# EAGLE design Watering_System_3.1 (EAGLE 9.6.2)
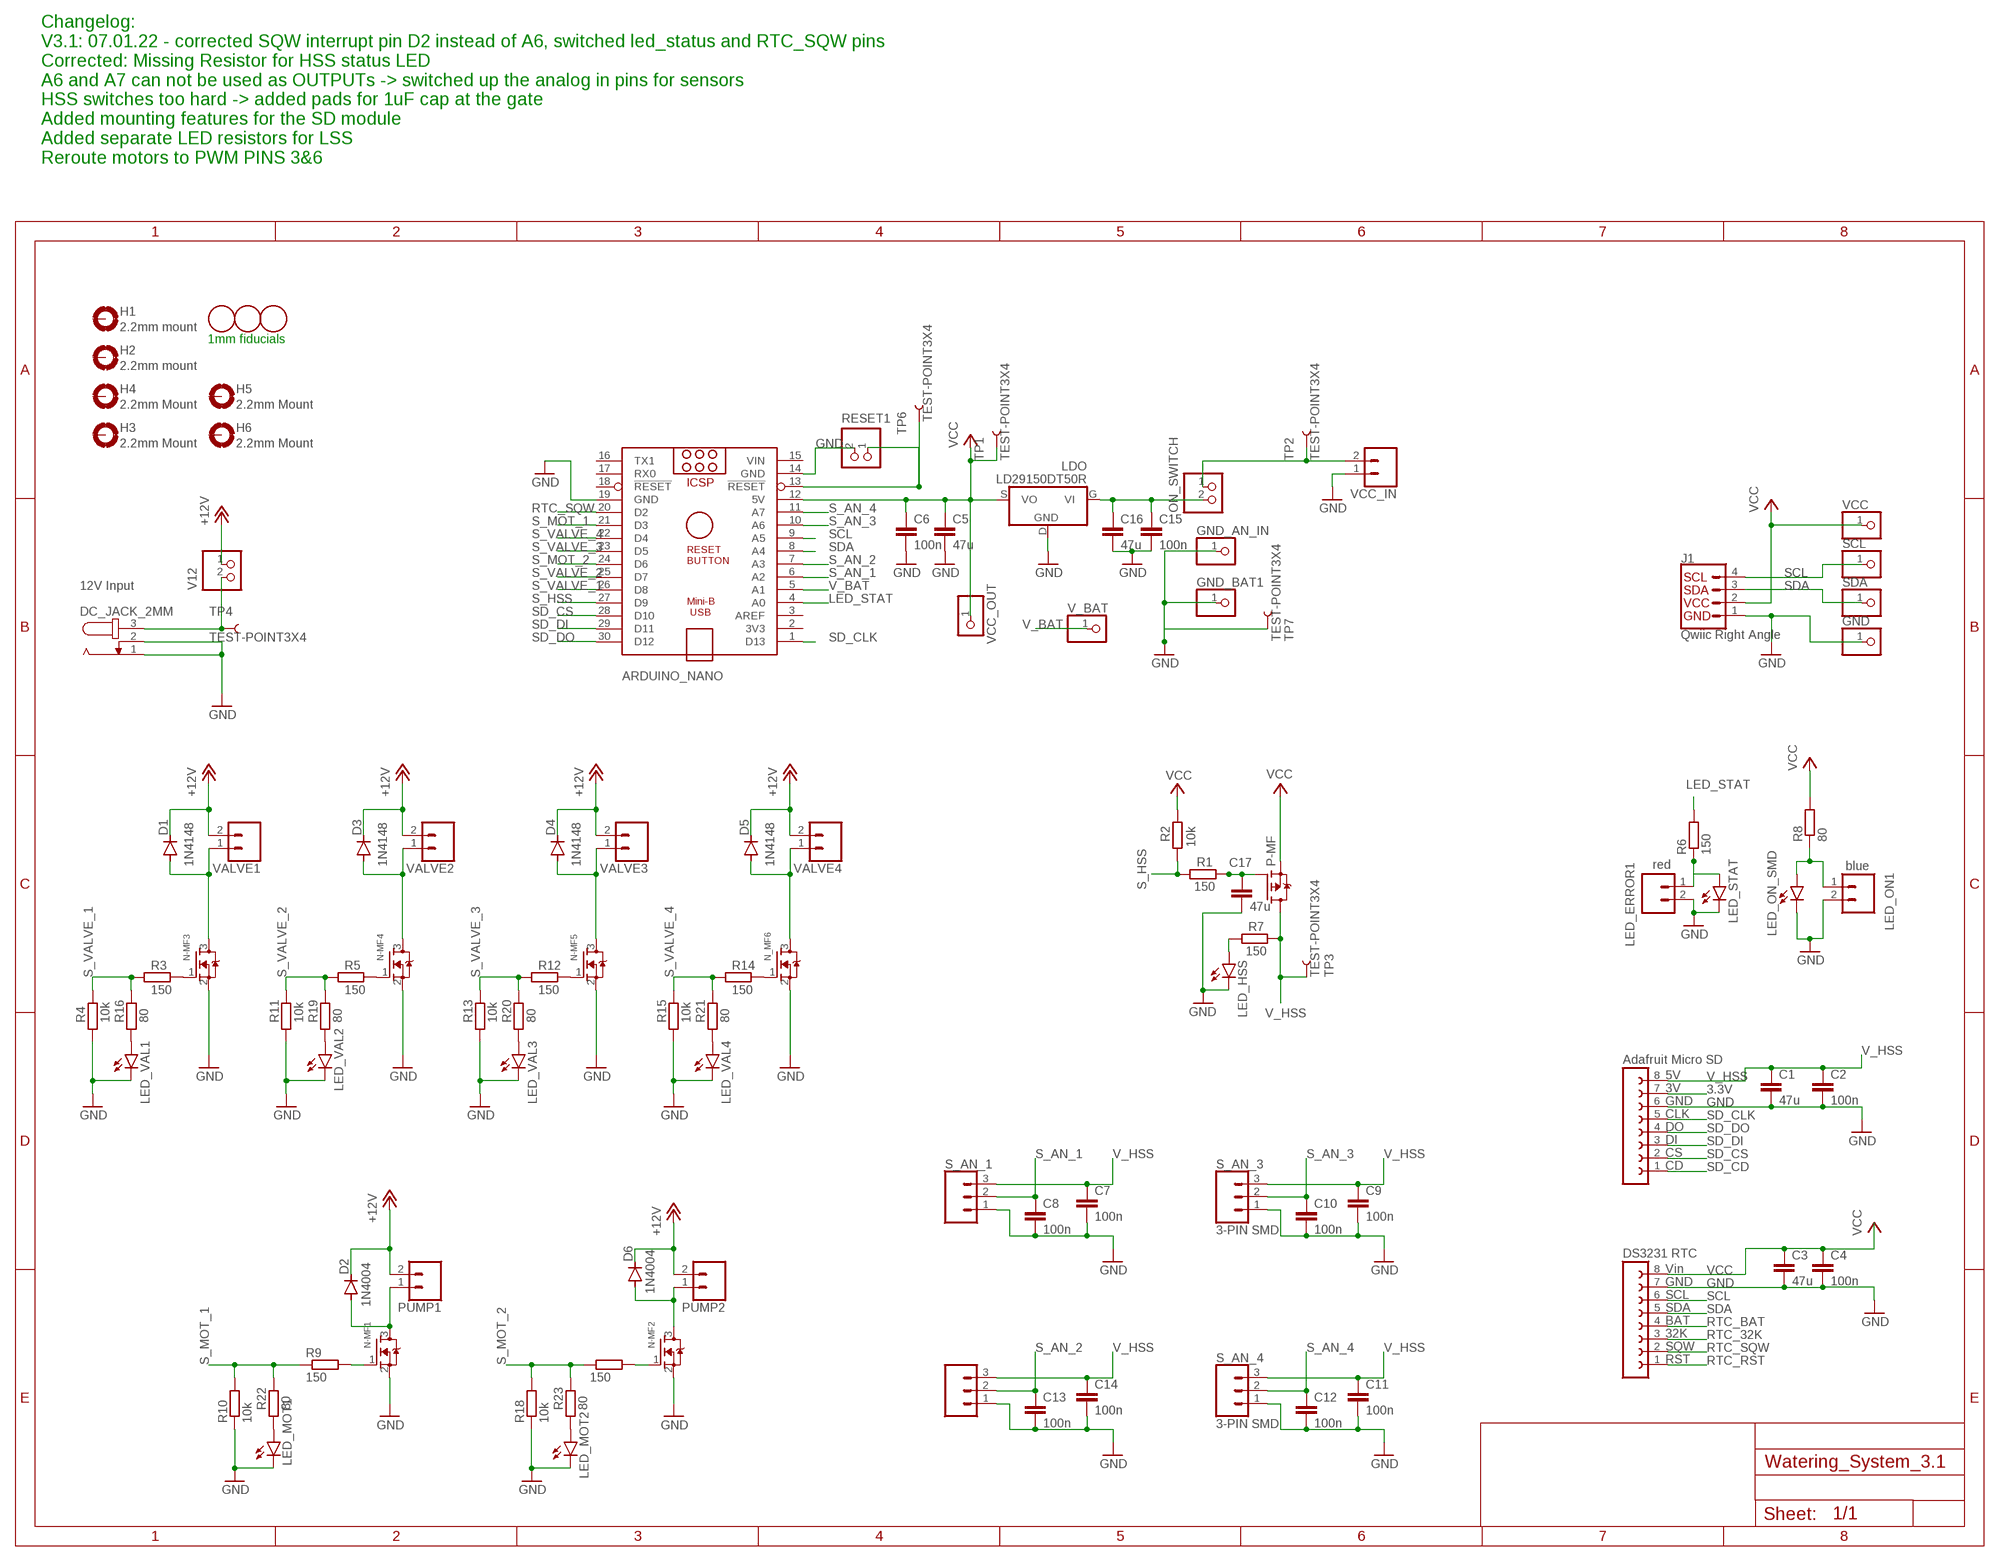
[diagram p0: schematic, sheet 1]

## Parts
ARDUINO_NANO  ARDUINO_NANO  [ARDUINO_NANO]
C1  47u  C-EUC0805  [C0805]
C2  100n  C-EUC0805  [C0805]
C3  47u  C-EUC0805  [C0805]
C4  100n  C-EUC0805  [C0805]
C5  47u  C-EUC0805  [C0805]
C6  100n  C-EUC0805  [C0805]
C7  100n  C-EUC0805  [C0805]
C8  100n  C-EUC0805  [C0805]
C9  100n  C-EUC0805  [C0805]
C10  100n  C-EUC0805  [C0805]
C11  100n  C-EUC0805  [C0805]
C12  100n  C-EUC0805  [C0805]
C13  100n  C-EUC0805  [C0805]
C14  100n  C-EUC0805  [C0805]
C15  100n  C-EUC0805  [C0805]
C16  47u  C-EUC0805  [C0805]
C17  47u  C-EUC0805  [C0805]
D1  1N4148  1N4148DO35-7  [DO35-7]
D2  1N4004  [DO41-10]
D3  1N4148  1N4148DO35-7  [DO35-7]
D4  1N4148  1N4148DO35-7  [DO35-7]
D5  1N4148  1N4148DO35-7  [DO35-7]
D6  1N4004  [DO41-10]
DC_JACK_2MM  12V Input  JACK-PLUG0  [SPC4077]
GND  PINHD-1X1  [1X01]
GND_AN_IN  PINHD-1X1  [1X01]
GND_BAT1  PINHD-1X1  [1X01]
H1  2.2mm mount  MOUNT-PAD-ROUND2.8  [2,2-PAD]
H2  2.2mm mount  MOUNT-PAD-ROUND2.8  [2,2-PAD]
H3  2.2mm Mount  MOUNT-PAD-ROUND2.8  [2,2-PAD]
H4  2.2mm Mount  MOUNT-PAD-ROUND2.8  [2,2-PAD]
H5  2.2mm Mount  MOUNT-PAD-ROUND2.8  [2,2-PAD]
H6  2.2mm Mount  MOUNT-PAD-ROUND2.8  [2,2-PAD]
J1  Qwiic Right Angle  I2C_STANDARDQWIIC  [1X04_1MM_RA]
LDO  LD29150DT50R  [DPACK_2]
LED_ERROR1  red  CONN_02  [1X02]
LED_HSS  LEDCHIPLED_0805  [CHIPLED_0805]
LED_MOT1  LEDCHIPLED_0805  [CHIPLED_0805]
LED_MOT2  LEDCHIPLED_0805  [CHIPLED_0805]
LED_ON1  blue  CONN_02  [1X02]
LED_ON_SMD  LEDCHIPLED_0805  [CHIPLED_0805]
LED_STAT  LEDCHIPLED_0805  [CHIPLED_0805]
LED_VAL1  LEDCHIPLED_0805  [CHIPLED_0805]
LED_VAL2  LEDCHIPLED_0805  [CHIPLED_0805]
LED_VAL3  LEDCHIPLED_0805  [CHIPLED_0805]
LED_VAL4  LEDCHIPLED_0805  [CHIPLED_0805]
N-MF1  IRLML6244TRPBF  [SOT23R_INFINEON]
N-MF2  IRLML6244TRPBF  [SOT23R_INFINEON]
N-MF3  IRLML6244TRPBF  [SOT23R_INFINEON]
N-MF4  IRLML6244TRPBF  [SOT23R_INFINEON]
N-MF5  IRLML6244TRPBF  [SOT23R_INFINEON]
N_MF6  IRLML6244TRPBF  [SOT23R_INFINEON]
ON_SWITCH  toggle_breakout  PINHD-1X2  [1X02]
P-MF  IRLML2244TRPBF  [SOT23R_INFINEON]
PUMP1  CONN_02-JST-2MM-SMT  [JST-2-SMD]
PUMP2  CONN_02-JST-2MM-SMT  [JST-2-SMD]
R1  150  R-EU_R0805  [R0805]
R2  10k  R-EU_R0805  [R0805]
R3  150  R-EU_R0805  [R0805]
R4  10k  R-EU_R0805  [R0805]
R5  150  R-EU_R0805  [R0805]
R6  150  R-EU_R0805  [R0805]
R7  150  R-EU_R0805  [R0805]
R8  80  R-EU_R0805  [R0805]
R9  150  R-EU_R0805  [R0805]
R10  10k  R-EU_R0805  [R0805]
R11  10k  R-EU_R0805  [R0805]
R12  150  R-EU_R0805  [R0805]
R13  10k  R-EU_R0805  [R0805]
R14  150  R-EU_R0805  [R0805]
R15  10k  R-EU_R0805  [R0805]
R16  80  R-EU_R0805  [R0805]
R17  150  R-EU_R0805  [R0805]
R18  10k  R-EU_R0805  [R0805]
R19  80  R-EU_R0805  [R0805]
R20  80  R-EU_R0805  [R0805]
R21  80  R-EU_R0805  [R0805]
R22  80  R-EU_R0805  [R0805]
R23  80  R-EU_R0805  [R0805]
RESET1  toggle_breakout  PINHD-1X2  [1X02]
RTC  DS3231  DS3231_RTC  [RTC]
S_AN_1  3-PIN SMD  CONN_03JST-SMD  [JST-3-SMD]
S_AN_2  3-PIN SMD  CONN_03JST-SMD  [JST-3-SMD]
S_AN_3  3-PIN SMD  CONN_03JST-SMD  [JST-3-SMD]
S_AN_4  3-PIN SMD  CONN_03JST-SMD  [JST-3-SMD]
SC_CARD  MIRCO_SD_ADAFRUITSD  [ADAFRUIT_SD]
SCL  PINHD-1X1  [1X01]
SDA  PINHD-1X1  [1X01]
TP1  TEST-POINT3X4  [PAD.03X.04]
TP2  TEST-POINT3X4  [PAD.03X.04]
TP3  TEST-POINT3X4  [PAD.03X.04]
TP4  TEST-POINT3X4  [PAD.03X.04]
TP6  TEST-POINT3X4  [PAD.03X.04]
TP7  TEST-POINT3X4  [PAD.03X.04]
U$1  FIDUCIAL  [FIDUCIAL_1MM]
U$2  FIDUCIAL  [FIDUCIAL_1MM]
U$3  FIDUCIAL  [FIDUCIAL_1MM]
V12  toggle_breakout  PINHD-1X2  [1X02]
V_BAT  PINHD-1X1  [1X01]
VALVE1  CONN_02-JST-2MM-SMT  [JST-2-SMD]
VALVE2  CONN_02-JST-2MM-SMT  [JST-2-SMD]
VALVE3  CONN_02-JST-2MM-SMT  [JST-2-SMD]
VALVE4  CONN_02-JST-2MM-SMT  [JST-2-SMD]
VCC  PINHD-1X1  [1X01]
VCC_IN  CONN_02-JST-2MM-SMT  [JST-2-SMD]
VCC_OUT  PINHD-1X1  [1X01]

## Nets
3.3V: SC_CARD.7(3V)
+12V: D1.C D2.C D3.C D4.C D5.C D6.C PUMP1.2 PUMP2.2 V12.1 VALVE1.2 VALVE2.2 VALVE3.2 VALVE4.2
GND: ARDUINO_NANO.14(GND) ARDUINO_NANO.19(GND) C1.2 C2.2 C3.2 C4.2 C5.2 C6.2 C7.2 C8.2 C9.2 C10.2 C11.2 C12.2 C13.2 C14.2 C15.2 C16.2 C17.2 DC_JACK_2MM.1 DC_JACK_2MM.2 GND.1 GND_AN_IN.1 GND_BAT1.1 J1.1 LDO.D(GND) LED_ERROR1.2 LED_HSS.C LED_MOT1.C LED_MOT2.C LED_ON1.2 LED_ON_SMD.C LED_STAT.C LED_VAL1.C LED_VAL2.C LED_VAL3.C LED_VAL4.C N-MF1.2(S) N-MF2.2(S) N-MF3.2(S) N-MF4.2(S) N-MF5.2(S) N_MF6.2(S) R4.1 R10.1 R11.1 R13.1 R15.1 R18.1 RESET1.2 RTC.7(GND) S_AN_1.1 S_AN_2.1 S_AN_3.1 S_AN_4.1 SC_CARD.6(GND) TP7.P$1 VCC_IN.1
LED_STAT: ARDUINO_NANO.4(A0) R6.2
N$1: N-MF1.1(G) R9.2
N$2: D3.A N-MF4.3(D) VALVE2.1
N$3: LED_ON1.1 LED_ON_SMD.A R8.1
N$4: N-MF2.1(G) R17.2
N$5: LED_ERROR1.1 LED_STAT.A R6.1
N$6: LED_HSS.A R7.1
N$7: D1.A N-MF3.3(D) VALVE1.1
N$8: N-MF4.1(G) R5.2
N$9: D4.A N-MF5.3(D) VALVE3.1
N$10: C17.1 P-MF.1(G) R1.2
N$11: N-MF3.1(G) R3.2
N$12: N-MF5.1(G) R12.2
N$13: D5.A N_MF6.3(D) VALVE4.1
N$14: N_MF6.1(G) R14.2
N$15: C15.1 C16.1 LDO.G(VI) ON_SWITCH.2
N$16: DC_JACK_2MM.3 TP4.P$1 V12.2
N$17: LED_VAL1.A R16.1
N$18: D2.A N-MF1.3(D) PUMP1.1
N$19: D6.A N-MF2.3(D) PUMP2.1
N$20: LED_VAL2.A R19.1
N$21: ARDUINO_NANO.13(!RESET) RESET1.1 TP6.P$1
N$22: ON_SWITCH.1 TP2.P$1 VCC_IN.2
N$23: LED_VAL3.A R20.1
N$24: LED_VAL4.A R21.1
N$25: LED_MOT1.A R22.1
N$26: LED_MOT2.A R23.1
RTC_32K: RTC.3(32K)
RTC_BAT: RTC.4(BAT)
RTC_RST: RTC.1(RST)
RTC_SQW: ARDUINO_NANO.20(D2) RTC.2(SQW)
S_AN_1: ARDUINO_NANO.6(A2) C8.1 S_AN_1.2
S_AN_2: ARDUINO_NANO.7(A3) C13.1 S_AN_2.2
S_AN_3: ARDUINO_NANO.10(A6) C10.1 S_AN_3.2
S_AN_4: ARDUINO_NANO.11(A7) C12.1 S_AN_4.2
S_HSS: ARDUINO_NANO.27(D9) R1.1 R2.1
S_MOT_1: ARDUINO_NANO.21(D3) R9.1 R10.2 R22.2
S_MOT_2: ARDUINO_NANO.24(D6) R17.1 R18.2 R23.2
S_VALVE_1: ARDUINO_NANO.26(D8) R3.1 R4.2 R16.2
S_VALVE_2: ARDUINO_NANO.25(D7) R5.1 R11.2 R19.2
S_VALVE_3: ARDUINO_NANO.23(D5) R12.1 R13.2 R20.2
S_VALVE_4: ARDUINO_NANO.22(D4) R14.1 R15.2 R21.2
SCL: ARDUINO_NANO.9(A5) J1.4 RTC.6(SCL) SCL.1
SD_CD: SC_CARD.1(CD)
SD_CLK: ARDUINO_NANO.1(D13) SC_CARD.5(CLK)
SD_CS: ARDUINO_NANO.28(D10) SC_CARD.2(CS)
SD_DI: ARDUINO_NANO.29(D11) SC_CARD.3(DI)
SD_DO: ARDUINO_NANO.30(D12) SC_CARD.4(DO)
SDA: ARDUINO_NANO.8(A4) J1.3 RTC.5(SDA) SDA.1
V_BAT: ARDUINO_NANO.5(A1) V_BAT.1
V_HSS: C1.1 C2.1 C7.1 C9.1 C11.1 C14.1 P-MF.3(D) R7.2 S_AN_1.3 S_AN_2.3 S_AN_3.3 S_AN_4.3 SC_CARD.8(5V) TP3.P$1
VCC: ARDUINO_NANO.12(5V) C3.1 C4.1 C5.1 C6.1 J1.2 LDO.S(VO) P-MF.2(S) R2.2 R8.2 RTC.8(VIN) TP1.P$1 VCC.1 VCC_OUT.1
Unconnected: ARDUINO_NANO.2(3V3) ARDUINO_NANO.3(AREF) ARDUINO_NANO.16(TX1) ARDUINO_NANO.17(RX0) ARDUINO_NANO.18(!RESET) H1.B2,2(MOUNT) H2.B2,2(MOUNT) H3.B2,2(MOUNT) H4.B2,2(MOUNT) H5.B2,2(MOUNT) H6.B2,2(MOUNT)

## Notes on the sheet
- Changelog:
  V3.1: 07.01.22 - corrected SQW interrupt pin D2 instead of A6, switched led_status and RTC_SQW pins
  Corrected: Missing Resistor for HSS status LED 
  A6 and A7 can not be used as OUTPUTs -> switched up the analog in pins for sensors
  HSS switches too hard -> added pads for 1uF cap at the gate 
  Added mounting features for the SD module
  Added separate LED resistors for LSS 
  Reroute motors to PWM PINS 3&6
- 1mm fiducials

## Power pins joined to a net without a drawn wire
VIN: ARDUINO_NANO.15(VIN)

## Library data of the parts
ARDUINO_NANO = ArduinoNanoV30_no_holes:ARDUINO_NANO: Arduino Nano V3.0 Overview: The Arduino Nano is a small, complete, and breadboard-friendly board based on the ATmega328 (Arduino Nano 3.x) or ATmega168 (Arduino Nano 2.x). It has more or less the same functionality of the Arduino Duemilanove, but in a different package. It lacks only a DC power jack, and works with a Mini-B USB cable instead of a standard one. The Nano was designed and is being produced by Gravitech. Specifications: Microcontroller Atmel ATmega168 or ATmega328 Operating Voltage (logic level) 5 V Input Voltage (recommended) 7-12 V Input Voltage (limits) 6-20 V Digital I/O Pins 14 (of which 6 provide PWM output) Analog Input Pins 8 DC Current per I/O Pin 40 mA Flash Memory 16 KB (ATmega168) or 32 KB (ATmega328) of which 2 KB used by bootloader SRAM 1 KB (ATmega168) or 2 KB (ATmega328) EEPROM 512 bytes (ATmega168) or 1 KB (ATmega328) Clock Speed 16 MHz Dimensions 0.73" x 1.70" Length 45 mm Width 18 mm Weigth 5 g Power: The Arduino Nano can be powered via the Mini-B USB connection, 6-20V unregulated external power supply (pin 30), or 5V regulated external power supply (pin 27). The power source is automatically selected to the highest voltage source. Memory: The ATmega168 has 16 KB of flash memory for storing code (of which 2 KB is used for the bootloader); the ATmega328 has 32 KB, (also with 2 KB used for the bootloader). The ATmega168 has 1 KB of SRAM and 512 bytes of EEPROM (which can be read and written with the EEPROM library); the ATmega328 has 2 KB of SRAM and 1 KB of EEPROM. Input and Output: Each of the 14 digital pins on the Nano can be used as an input or output, using pinMode(), digitalWrite(), and digitalRead() functions. They operate at 5 volts. Each pin can provide or receive a maximum of 40 mA and has an internal pull-up resistor (disconnected by default) of 20-50 kOhms. In addition, some pins have specialized functions. Visit Arduino - ArduinoBoardNano <https://www.arduino.cc/en/Main/ArduinoBoardNano>
C1-C17 = rcl:C-EU: CAPACITOR, European symbol; SPICEPREFIX: C
D1 D3-D5 = diode:1N4148: DIODE high speed (Philips)
D2 D6 = diode:1N4004: DIODE general purpose rectifier, 1 A
DC_JACK_2MM = con-jack:JACK-PLUG: DC POWER JACK Power Jack, DC, Right Angle, Through Hole, Rated 5A at 16VDC, PC Terminals Distributor: Farnell (www.Farnell.de) Drawing: 84N1161.pdf / 84N1162.pdf Manufacturer: SPC Technology (www.spctechnology.com) Type: SPC4077 / SPC 4078; OC_FARNELL: unknown; OC_NEWARK: unknown
GND GND_AN_IN GND_BAT1 SCL SDA V_BAT VCC VCC_OUT = adafruit:PINHD-1X1: Pin header 1x1 for 0.1" spacing With round pins
H1-H6 = MeineBauteile:MOUNT-PAD-ROUND: MOUNTING PAD, round
J1 = SparkFun-Connectors:I2C_STANDARD: SparkFun I2C Standard Pinout Header SparkFun has standardized on a pinout for all I2C based sensor breakouts. This pinout allows I2C boards to be plugged directly into the headers on Arduino Uno compatible boards, and to be daisy chained easily. Example SparkFun Products: SparkFun Atmospheric Sensor Breakout - BME280 <https://www.sparkfun.com/products/13676> SparkFun Altitude/Pressure Sensor Breakout - MPL3115A2 <https://www.sparkfun.com/products/11084> SparkFun TOF Range Finder Sensor - VL6180 <https://www.sparkfun.com/products/12785>; PROD_ID: CONN-13729
LDO = MeineBauteile:LD29150DT50R: Low Dropout Regulator STMicroelectronics Datasheet: https://datasheet.lcsc.com/szlcsc/1806112227_STMicroelectronics-LD29150DT50R_C157411.pdf
LED_ERROR1 LED_ON1 = SparkFun-Connectors:CONN_02: Multi connection point. Often used as Generic Header-pin footprint for 0.1 inch spaced/style header connections On any of the 0.1 inch spaced packages, you can populate with these: Break Away Headers - Straight <https://www.sparkfun.com/products/116> (PRT-00116) Break Away Male Headers - Right Angle <https://www.sparkfun.com/products/553> (PRT-00553) Female Headers <https://www.sparkfun.com/products/115> (PRT-00115) Break Away Headers - Machine Pin <https://www.sparkfun.com/products/117> (PRT-00117) Break Away Female Headers - Swiss Machine Pin <https://www.sparkfun.com/products/743> (PRT-00743) For SCREWTERMINALS and SPRING TERMINALS visit here: Screw Terimnals on SparkFun.com <https://www.sparkfun.com/search/results?term=Screw+Terminals> (5mm/3.5mm/2.54mm spacing) This device is also useful as a general connection point to wire up your design to another part of your project. Our various solder wires solder well into these plated through hole pads. Hook-Up Wire - Assortment (Stranded, 22 AWG) <https://www.sparkfun.com/products/11375> (PRT-11375) Hook-Up Wire - Assortment (Solid Core, 22 AWG) <https://www.sparkfun.com/products/11367> (PRT-11367) View the entire wire category on our website here <https://www.sparkfun.com/categories/141> Special notes: Molex polarized connector foot print use with: PRT-08233 with associated crimp pins and housings. 2.54_SCREWTERM for use with PRT-10571. 3.5mm Screw Terminal footprints for PRT-08084 5mm Screw Terminal footprints for use with PRT-08432
LED_HSS LED_MOT1 LED_MOT2 LED_ON_SMD LED_STAT LED_VAL1-LED_VAL4 = led:LED: LED OSRAM: - CHIPLED LG R971, LG N971, LY N971, LG Q971, LY Q971, LO R971, LY R971 LH N974, LH R974 LS Q976, LO Q976, LY Q976 LO Q996 - Hyper CHIPLED LW Q18S LB Q993, LB Q99A, LB R99A - SideLED LS A670, LO A670, LY A670, LG A670, LP A670 LB A673, LV A673, LT A673, LW A673 LH A674 LY A675 LS A676, LA A676, LO A676, LY A676, LW A676 LS A679, LY A679, LG A679 - Hyper Micro SIDELED® LS Y876, LA Y876, LO Y876, LY Y876 LT Y87S - SmartLED LW L88C, LW L88S LB L89C, LB L89S, LG L890 LS L89K, LO L89K, LY L89K LS L896, LA L896, LO L896, LY L896 - TOPLED LS T670, LO T670, LY T670, LG T670, LP T670 LSG T670, LSP T670, LSY T670, LOP T670, LYG T670 LG T671, LOG T671, LSG T671 LB T673, LV T673, LT T673, LW T673 LH T674 LS T676, LA T676, LO T676, LY T676, LB T676, LH T676, LSB T676, LW T676 LB T67C, LV T67C, LT T67C, LS T67K, LO T67K, LY T67K, LW E67C LS E67B, LA E67B, LO E67B, LY E67B, LB E67C, LV E67C, LT E67C LW T67C LS T679, LY T679, LG T679 LS T770, LO T770, LY T770, LG T770, LP T770 LB T773, LV T773, LT T773, LW T773 LH T774 LS E675, LA E675, LY E675, LS T675 LS T776, LA T776, LO T776, LY T776, LB T776 LHGB T686 LT T68C, LB T68C - Hyper Mini TOPLED® LB M676 - Mini TOPLED Santana® LG M470 LS M47K, LO M47K, LY M47K Source: http://www.osram.convergy.de LUXEON: - LUMILED® LXK2-PW12-R00, LXK2-PW12-S00, LXK2-PW14-U00, LXK2-PW14-V00 LXK2-PM12-R00, LXK2-PM12-S00, LXK2-PM14-U00 LXK2-PE12-Q00, LXK2-PE12-R00, LXK2-PE12-S00, LXK2-PE14-T00, LXK2-PE14-U00 LXK2-PB12-K00, LXK2-PB12-L00, LXK2-PB12-M00, LXK2-PB14-N00, LXK2-PB14-P00, LXK2-PB14-Q00 LXK2-PR12-L00, LXK2-PR12-M00, LXK2-PR14-Q00, LXK2-PR14-R00 LXK2-PD12-Q00, LXK2-PD12-R00, LXK2-PD12-S00 LXK2-PH12-R00, LXK2-PH12-S00 LXK2-PL12-P00, LXK2-PL12-Q00, LXK2-PL12-R00 Source: www.luxeon.com KINGBRIGHT: KA-3528ASYC Source: www.kingbright.com
N-MF1-N-MF5 N_MF6 = MeineBauteile:IRLML6244TRPBF: Infineon N Channel MOSFET V_DS = 20V V_GS = +-12V https://lcsc.com/product-detail/MOSFET_Infineon-Technologies-IRLML6244TRPBF_C143946.html Datasheet: https://datasheet.lcsc.com/szlcsc/1810010522_Infineon-Technologies-IRLML6244TRPBF_C143946.pdf
ON_SWITCH RESET1 V12 = pinhead:PINHD-1X2: PIN HEADER
P-MF = MeineBauteile:IRLML2244TRPBF: Infineon P Channel MOSFET Datasheet: https://datasheet.lcsc.com/szlcsc/1808281739_Infineon-Technologies-IRLML2244TRPBF_C169763.pdf
PUMP1 PUMP2 VALVE1-VALVE4 VCC_IN = SparkFun-Connectors:CONN_02: Multi connection point. Often used as Generic Header-pin footprint for 0.1 inch spaced/style header connections On any of the 0.1 inch spaced packages, you can populate with these: Break Away Headers - Straight <https://www.sparkfun.com/products/116> (PRT-00116) Break Away Male Headers - Right Angle <https://www.sparkfun.com/products/553> (PRT-00553) Female Headers <https://www.sparkfun.com/products/115> (PRT-00115) Break Away Headers - Machine Pin <https://www.sparkfun.com/products/117> (PRT-00117) Break Away Female Headers - Swiss Machine Pin <https://www.sparkfun.com/products/743> (PRT-00743) For SCREWTERMINALS and SPRING TERMINALS visit here: Screw Terimnals on SparkFun.com <https://www.sparkfun.com/search/results?term=Screw+Terminals> (5mm/3.5mm/2.54mm spacing) This device is also useful as a general connection point to wire up your design to another part of your project. Our various solder wires solder well into these plated through hole pads. Hook-Up Wire - Assortment (Stranded, 22 AWG) <https://www.sparkfun.com/products/11375> (PRT-11375) Hook-Up Wire - Assortment (Solid Core, 22 AWG) <https://www.sparkfun.com/products/11367> (PRT-11367) View the entire wire category on our website here <https://www.sparkfun.com/categories/141> Special notes: Molex polarized connector foot print use with: PRT-08233 with associated crimp pins and housings. 2.54_SCREWTERM for use with PRT-10571. 3.5mm Screw Terminal footprints for PRT-08084 5mm Screw Terminal footprints for use with PRT-08432; PROD_ID: CONN-11443
R1-R23 = rcl:R-EU_: RESISTOR, European symbol; SPICEPREFIX: R
RTC = MeineBauteile:DS3231_RTC: FEMALE HEADER; OC_FARNELL: unknown; OC_NEWARK: unknown
S_AN_1-S_AN_4 = SparkFun-Connectors:CONN_03: Multi connection point. Often used as Generic Header-pin footprint for 0.1 inch spaced/style header connections On any of the 0.1 inch spaced packages, you can populate with these: Break Away Headers - Straight <https://www.sparkfun.com/products/116> (PRT-00116) Break Away Male Headers - Right Angle <https://www.sparkfun.com/products/553> (PRT-00553) Female Headers <https://www.sparkfun.com/products/115> (PRT-00115) Break Away Headers - Machine Pin <https://www.sparkfun.com/products/117> (PRT-00117) Break Away Female Headers - Swiss Machine Pin <https://www.sparkfun.com/products/743> (PRT-00743) Stackable Header - 3 Pin (Female, 0.1") <https://www.sparkfun.com/products/13875> (PRT-13875) For SCREWTERMINALS and SPRING TERMINALS visit here: Screw Terimnals on SparkFun.com <https://www.sparkfun.com/search/results?term=Screw+Terminals> (5mm/3.5mm/2.54mm spacing) This device is also useful as a general connection point to wire up your design to another part of your project. Our various solder wires solder well into these plated through hole pads. Hook-Up Wire - Assortment (Stranded, 22 AWG) <https://www.sparkfun.com/products/11375> (PRT-11375) Hook-Up Wire - Assortment (Solid Core, 22 AWG) <https://www.sparkfun.com/products/11367> (PRT-11367) View the entire wire category on our website here <https://www.sparkfun.com/categories/141> Special notes: Molex polarized connector foot print use with SKU : PRT-08232 with associated crimp pins and housings.; PROD_ID: CONN-12591
SC_CARD = MeineBauteile:MIRCO_SD_ADAFRUIT: FEMALE HEADER
TP1-TP4 TP6 TP7 = SparkFun-Connectors:TEST-POINT: SparkFun Test Points Bare copper test points for troubleshooting or In-Circuit-Testing. These are used by our Production team for verifying production board runs using pogo-pins on test beds. SparkFun Products: SparkFun LSM9DS1 Breakout <https://www.sparkfun.com/products/13284> SparkFun PSOC <https://www.sparkfun.com/products/13714> SparkFun Load Cell Amplifier <https://www.sparkfun.com/products/13879>
U$1-U$3 = adafruit:FIDUCIAL: For use by pick and place machines to calibrate the vision/machine, 1mm By microbuilder.eu

## Board
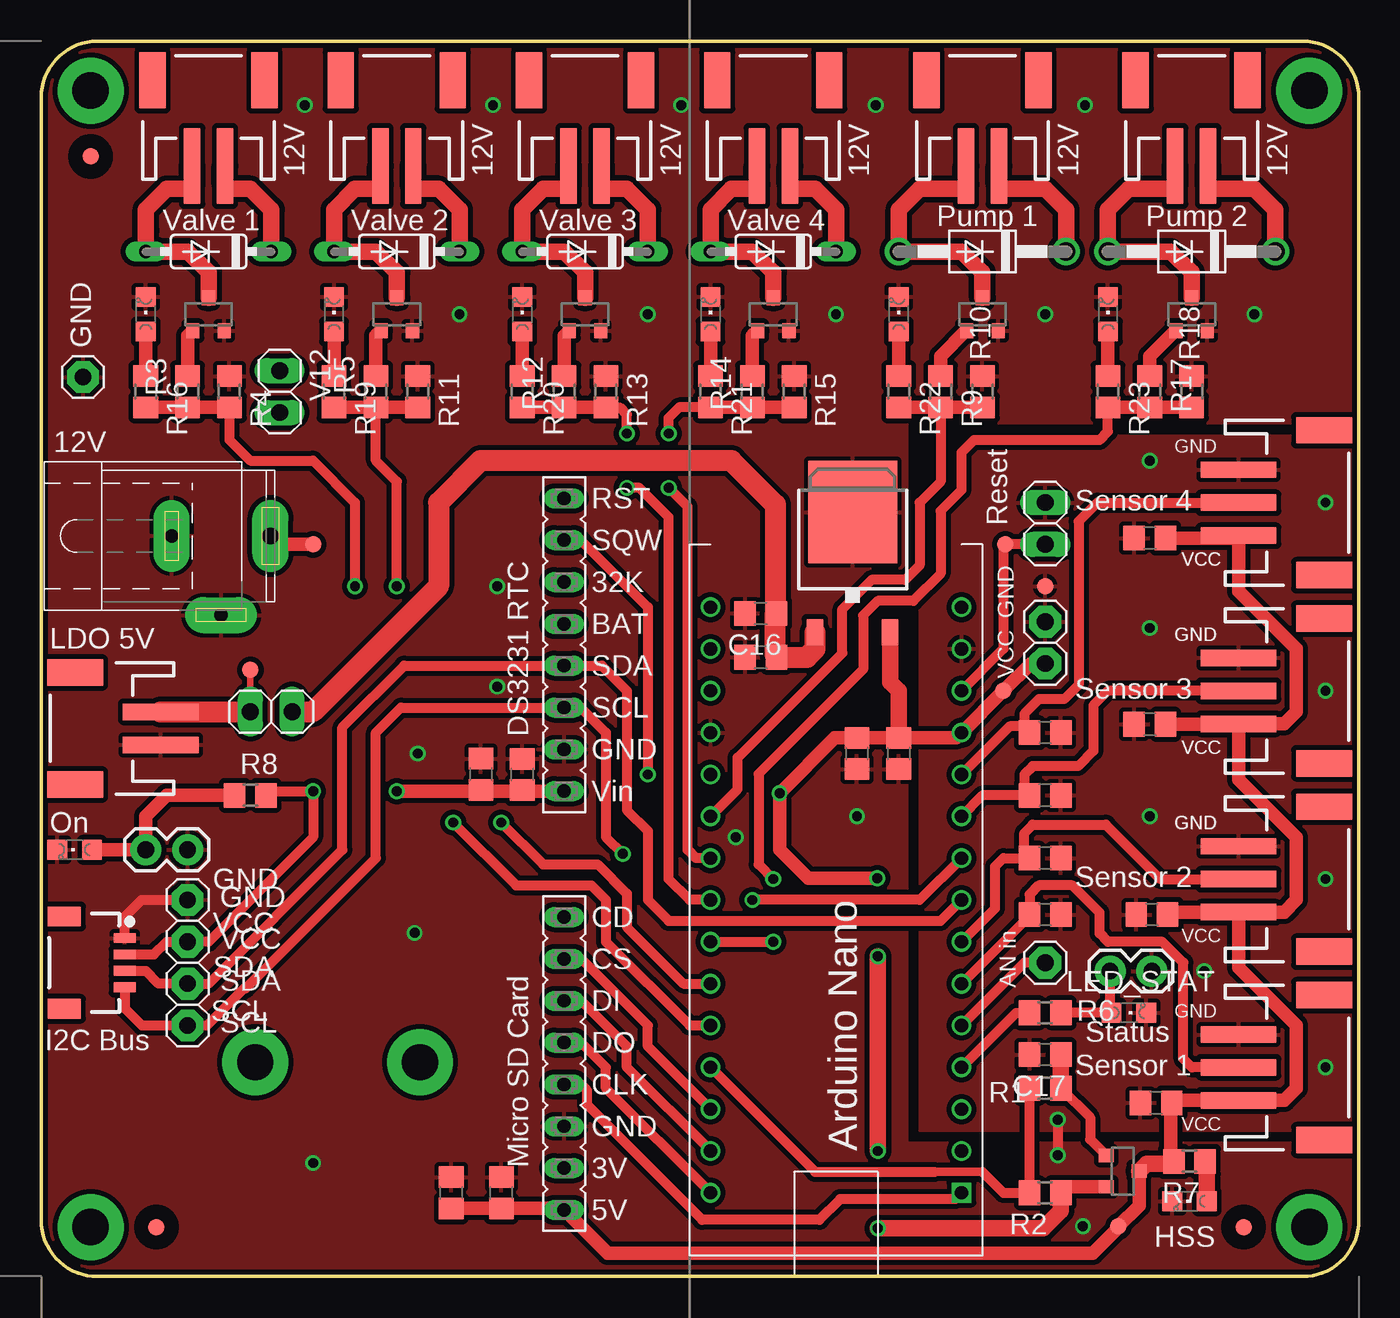
[diagram p1: board, top side]
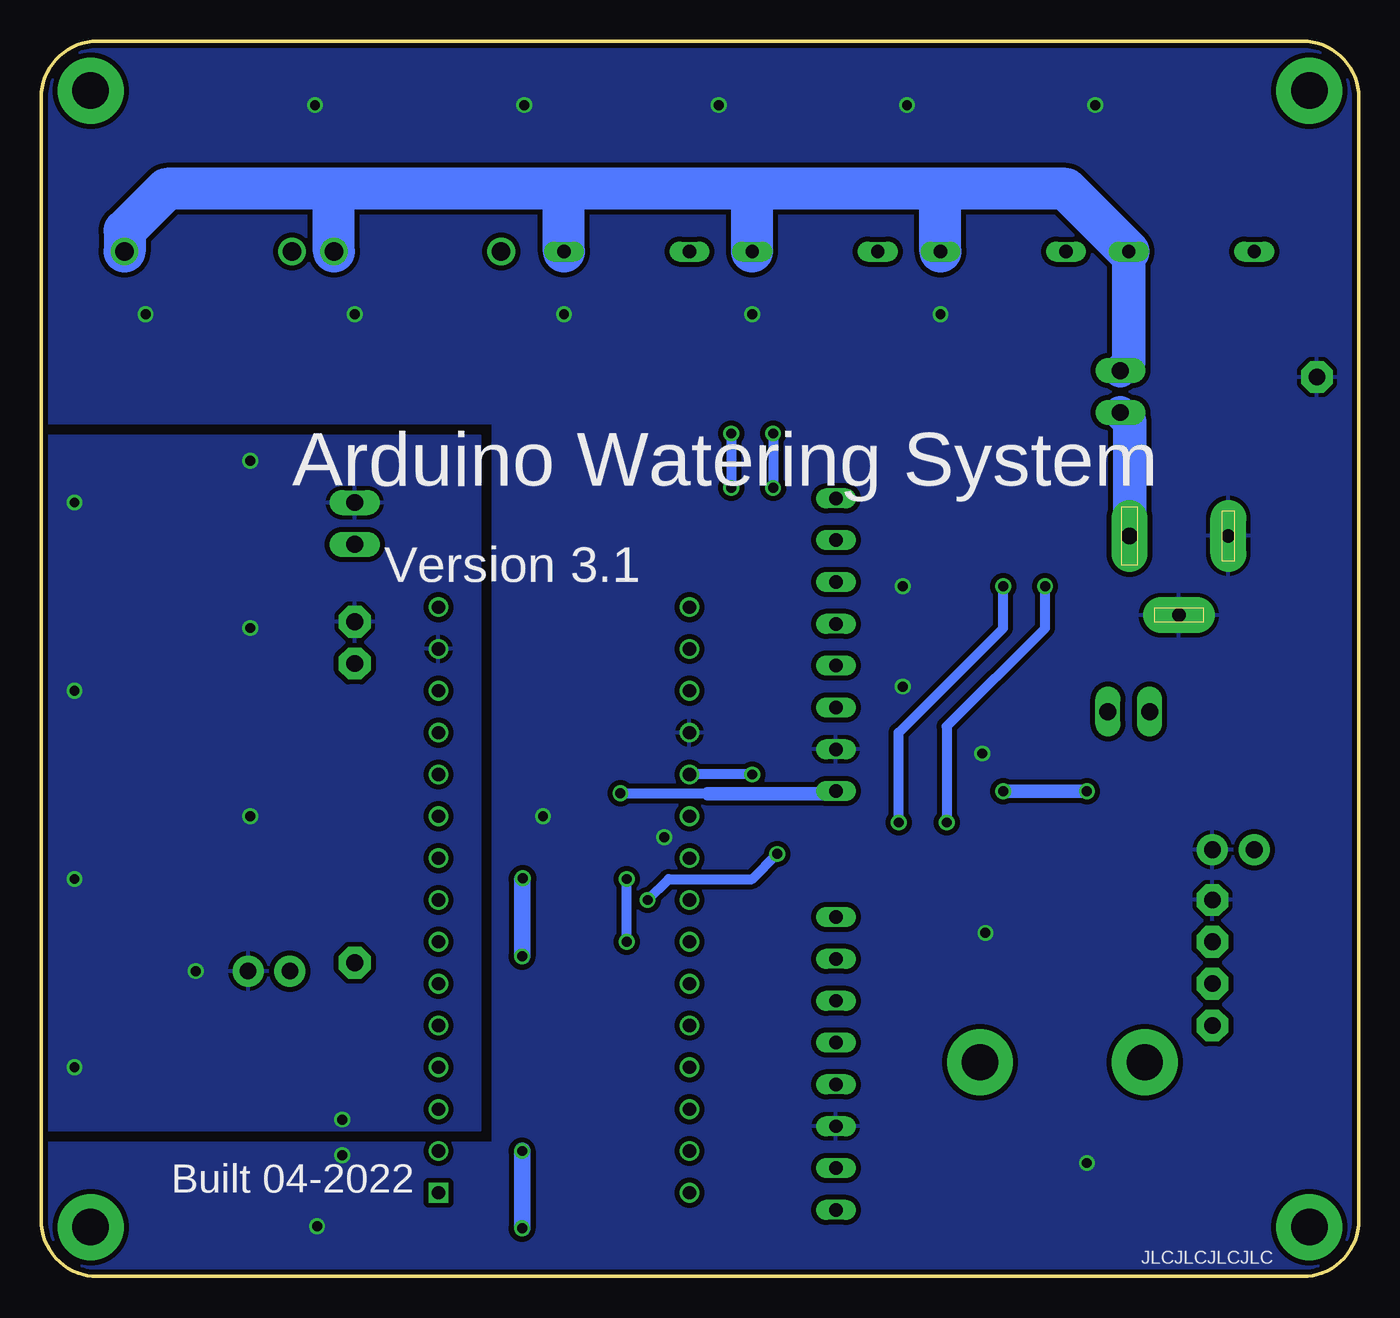
[diagram p2: board, bottom side, seen from below]

Size 80 x 75 mm. Coordinates in mm from the lower left corner, seen from the top.
Outline: 0,3.41 0,71.59 arc-90 3.41,75 76.59,75 arc-90 80,71.59 80,3.41 arc-90 76.59,0 3.41,0 arc-90 0,3.41
Copper layers (1*16): Top 0.035mm / dielectric 1.5mm / Bottom 0.035mm
Design rules "SparkFun-2-Layer-General-JLCPCB": minimum track width 7mil, minimum drill 0.3mm, track to track 7mil, track to pad 7mil, pad to pad 7mil, via to via 7mil, smd to smd 7mil, copper to edge 7mil, drill to drill 7mil, minimum pad ring 7mil, minimum via ring 7mil, stop-mask expansion 3mil, vias tented up to drill 25mil, thermal gap 10mil

### Footprints (pad centres in the part's own frame; a part is rotated, then mirrored left to right if it is on the bottom)
ARDUINO_NANO = drill 0.8 square: 1 -20.32,-7.62 | drill 0.8: 2 -17.78,-7.62; 3 -15.24,-7.62; 4 -12.7,-7.62; 5 -10.16,-7.62; 6 -7.62,-7.62; 7 -5.08,-7.62; 8 -2.54,-7.62; 9 0,-7.62; 10 2.54,-7.62; 11 5.08,-7.62; 12 7.62,-7.62; 13 10.16,-7.62; 14 12.7,-7.62; 15 15.24,-7.62; 16 15.24,7.62; 17 12.7,7.62; 18 10.16,7.62; 19 7.62,7.62; 20 5.08,7.62; 21 2.54,7.62; 22 0,7.62; 23 -2.54,7.62; 24 -5.08,7.62; 25 -7.62,7.62; 26 -10.16,7.62; 27 -12.7,7.62; 28 -15.24,7.62; 29 -17.78,7.62; 30 -20.32,7.62
C0805 = smd 1.3 x 1.5: 1 -0.95,0; 2 0.95,0
DO35-7 = drill 0.813 long: A 3.81,0; C -3.81,0
DO41-10 = drill 1.118: A 5.08,0; C -5.08,0
SPC4077 = drill 0.8 pad 2.184 long: 1 -3,0; 2 0,-4.8 | drill 1 pad 2.184 long: 3 3,0
1X01 = drill 1.016 pad 1.93 octagon: 1 0,0
2,2-PAD = drill 2.2 pad 4: B2,2 0,0
1X04_1MM_RA = smd 0.6 x 1.35: 1 -1.5,0; 2 -0.5,0; 3 0.5,0; 4 1.5,0 | smd 1.2 x 2: NC1 2.8,-3.675; NC2 -2.8,-3.675
DPACK_2 = smd 5.4 x 6.2: D 0,2.5 | smd 1 x 1.6: G -2.28,-4.8; S 2.28,-4.8
1X02 = drill 1.016 pad 1.88: 1 0,0; 2 2.54,0
CHIPLED_0805 = smd 1.2 x 1.2: A 0,-1.05; C 0,1.05
SOT23R_INFINEON = smd 0.8 x 0.9: 1 -0.95,-1; 2 0.95,-1; 3 0,1
1X02' = drill 1.016 long: 1 -1.27,0; 2 1.27,0
JST-2-SMD = smd 1 x 4.6: 1 -1,-3.7; 2 1,-3.7 | smd 1.6 x 3.4: NC1 -3.4,1.5; NC2 3.4,1.5
R0805 = smd 1.3 x 1.5: 1 -0.95,0; 2 0.95,0
RTC = drill 0.813 long: 1 -8.89,0; 2 -6.35,0; 3 -3.81,0; 4 -1.27,0; 5 1.27,0; 6 3.81,0; 7 6.35,0; 8 8.89,0
JST-3-SMD = smd 1 x 4.6: 1 -1.99,-4.77; 2 0.01,-4.77; 3 2.01,-4.77 | smd 1.6 x 3.4: NC1 -4.39,0.43; NC2 4.41,0.43
ADAFRUIT_SD = drill 0.813 long: 1 -8.89,0; 2 -6.35,0; 3 -3.81,0; 4 -1.27,0; 5 1.27,0; 6 3.81,0; 7 6.35,0; 8 8.89,0
PAD.03X.04 = smd 1.016 x 1.016: P$1 0,0
FIDUCIAL_1MM = smd 1 x 1: 1 0,0

### Placement (x,y rotation side)
ARDUINO_NANO  48.26,25.4 90 top
C1  27.94,5.08 90 top
C2  24.89,5.08 90 top
C3  26.7,30.5 90 top
C4  29.21,30.48 90 top
C5  49.53,31.75 270 top
C6  52.07,31.75 270 top
C7  67.69,10.54 180 top
C8  60.96,21.97 0 top
C9  67.31,33.53 180 top
C10  60.96,29.21 0 top
C11  67.31,44.83 180 top
C12  60.96,33.02 0 top
C13  60.96,25.4 0 top
C14  67.44,21.97 180 top
C15  43.69,37.59 180 top
C16  43.69,40.26 180 top
C17  60.96,13.47 180 top
D1  10.16,62.23 180 top
D2  57.15,62.23 180 top
D3  21.59,62.23 180 top
D4  33.02,62.23 180 top
D5  44.45,62.23 180 top
D6  69.85,62.23 180 top
DC_JACK_2MM  10.92,44.96 0 top
GND  8.89,22.86 0 top
GND_AN_IN  60.96,39.75 0 top
GND_BAT1  2.54,54.61 0 top
H1  77,3 0 top
H2  3,3 0 top
H3  3,72 0 top
H4  77,72 0 top
H5  23,13 0 top
H6  13,13 0 top
J1  5.08,19.05 270 top
LDO  49.26,43.91 0 top
LED_ERROR1  64.9,18.54 0 top
LED_HSS  69.72,4.57 90 top
LED_MOT1  52.07,58.42 0 top
LED_MOT2  64.77,58.42 0 top
LED_ON1  6.35,25.91 0 top
LED_ON_SMD  2.03,25.91 90 top
LED_STAT  66.04,16.01 270 top
LED_VAL1  6.35,58.42 0 top
LED_VAL2  17.78,58.42 0 top
LED_VAL3  29.21,58.42 0 top
LED_VAL4  40.64,58.42 0 top
N-MF1  57.15,58.42 0 top
N-MF2  69.85,58.42 0 top
N-MF3  10.16,58.42 0 top
N-MF4  21.59,58.42 0 top
N-MF5  33.02,58.42 0 top
N_MF6  44.45,58.42 0 top
ON_SWITCH  toggle_breakout  [1X02']  13.97,34.29 0 top
P-MF  65.66,6.4 270 top
PUMP1  57.15,71.12 0 top
PUMP2  69.85,71.12 0 top
R1  60.96,11.43 0 top
R2  60.96,5.08 0 top
R3  8.89,53.72 90 top
R4  11.43,53.72 270 top
R5  20.32,53.72 90 top
R6  60.96,16.01 180 top
R7  69.72,6.99 180 top
R8  12.7,29.21 0 top
R9  54.61,53.72 90 top
R10  57.15,53.72 270 top
R11  22.86,53.72 270 top
R12  31.75,53.72 90 top
R13  34.29,53.72 270 top
R14  43.18,53.72 90 top
R15  45.72,53.72 270 top
R16  6.35,53.72 270 top
R17  67.31,53.72 90 top
R18  69.85,53.72 270 top
R19  17.78,53.72 270 top
R20  29.21,53.72 270 top
R21  40.64,53.72 270 top
R22  52.07,53.72 270 top
R23  64.77,53.72 270 top
RESET1  toggle_breakout  [1X02']  60.96,45.72 90 top
RTC  31.75,38.35 270 top
S_AN_1  77.47,12.7 270 top
S_AN_2  77.47,24.13 270 top
S_AN_3  77.47,35.56 270 top
S_AN_4  77.47,46.99 270 top
SC_CARD  31.75,12.93 270 top
SCL  8.89,15.24 0 top
SDA  8.89,17.78 0 top
TP1  58.42,35.56 0 top
TP2  12.7,36.83 0 top
TP3  65.41,3.05 270 top
TP4  16.51,44.45 0 top
TP6  58.55,44.45 0 top
TP7  60.96,41.91 0 top
U$1  7,3 0 top
U$2  3,68 0 top
U$3  73,3 0 top
V12  toggle_breakout  [1X02']  14.48,53.72 270 top
V_BAT  60.96,19.05 0 top
VALVE1  10.16,71.12 0 top
VALVE2  21.59,71.12 0 top
VALVE3  33.02,71.12 0 top
VALVE4  44.45,71.12 0 top
VCC  8.89,20.32 0 top
VCC_IN  3.56,33.27 90 top
VCC_OUT  60.96,37.21 0 top

### Tracks (layer width: path | path; a pad name or v marks a point on that pad's centre or on a via)
+12V
  Top 1.016: D3.C 25.4,64.77 24.13,66.04 22.86,66.04 22.59,66.31 VALVE2.2 | D4.C 36.83,64.77 35.56,66.04 34.29,66.04 34.02,66.31 VALVE3.2 | D5.C 48.26,64.77 46.99,66.04 45.72,66.04 45.45,66.31 VALVE4.2 | D2.C 62.23,64.77 60.96,66.04 58.42,66.04 58.15,66.31 PUMP1.2 | D6.C 74.93,64.77 73.66,66.04 71.12,66.04 70.85,66.31 PUMP2.2 | VALVE1.2 11.16,66.31 11.43,66.04 12.7,66.04 13.97,64.77 D1.C
  Bottom 2.032: V12.1 13.97,55.5 D1.C
  Bottom 2.54: D6.C 74.93,63.5 72.39,66.04 62.23,66.04 | 25.4,66.04 17.78,66.04 D1.C | 25.4,66.04 36.83,66.04 | 36.83,66.04 48.26,66.04 | 48.26,66.04 62.23,66.04 | D3.C 25.4,66.04 | D4.C 36.83,66.04 | D5.C 48.26,66.04 | D2.C 62.23,66.04
GND  (via drill 0.6)
  Top 0.61: GND.1 6.1,22.86 5.08,21.84 J1.1 | v61.72,9.53 v61.72,7.37
  other vias: 25.4,58.42 36.83,58.42 48.26,58.42 22.86,31.75 16.51,6.89 22.67,20.86 67.31,39.37 67.31,27.94 70.61,18.54 67.31,49.53 60.96,58.42 73.66,58.42 27.69,41.91 77.98,12.7 77.98,24.13 77.98,35.56 77.98,46.99 63.25,3.05 16,71.12 27.43,71.12 38.86,71.12 50.67,71.12 63.37,71.12 49.53,27.94 27.69,35.81 42.16,26.67
  pour Top (isolate 0.305): 83.31,51.05 53.34,51.05 53.34,8.85 83.31,8.85
  pour Top (isolate 0.305): -1.27,76.2 82.55,76.2 82.55,51.82 52.58,51.82 52.58,8.13 81.28,8.13 81.28,-1.27 -1.27,-1.27
  pour Bottom (isolate 0.305): -1.27,77.47 83.31,77.47 83.31,51.82 52.58,51.82 52.58,8.13 81.28,8.13 81.28,-1.27 -1.27,-1.27
  pour Bottom (isolate 0.305): 53.34,51.05 82.55,51.05 82.55,8.89 53.34,8.89
LED_STAT
  Top 0.61: ARDUINO_NANO.4 59.19,16.01 R6.2
N$1
  Top 0.813: R9.2 54.61,55.88 56.15,57.42 N-MF1.1
N$2
  Top 1.016: VALVE2.1 20.59,66.31 20.32,66.04 19.05,66.04 17.78,64.77 D3.A 20.32,62.23 21.59,60.96 N-MF4.3
N$3
  Top 0.813: LED_ON_SMD.A LED_ON1.1 6.35,27.94 7.62,29.21 R8.1
N$4
  Top 0.813: R17.2 67.31,55.88 68.85,57.42 N-MF2.1
N$5
  Top 0.61: LED_ERROR1.1 64.9,16.1 LED_STAT.A R6.1
N$6
  Top 1.016: R7.1 70.77,6.88 LED_HSS.A
N$7
  Top 1.016: VALVE1.1 9.16,66.31 8.89,66.04 7.62,66.04 6.35,64.77 6.35,63.5 D1.A 8.89,62.23 10.16,60.96 N-MF3.3
N$8
  Top 0.813: N-MF4.1 20.32,57.1 R5.2
N$9
  Top 1.016: VALVE3.1 32.02,66.31 31.75,66.04 30.48,66.04 29.21,64.77 D4.A 31.75,62.23 33.02,60.96 N-MF5.3
N$10
  Top 0.61: P-MF.1 63.69,8.32 63.69,9.65 R1.2
  Top 1.016: C17.1 R1.2
N$11
  Top 0.813: N-MF3.1 8.89,57.1 R3.2
N$12
  Top 0.813: N-MF5.1 31.75,57.1 R12.2
N$13
  Top 1.016: VALVE4.1 43.45,66.31 43.18,66.04 41.91,66.04 40.64,64.77 D5.A 43.18,62.23 44.45,60.96 N_MF6.3
N$14
  Top 0.813: R14.2 43.18,57.1 N_MF6.1
N$15
  Top 1.27: ON_SWITCH.2 16.51,34.29 24.13,41.91 24.13,46.99 26.67,49.53 41.91,49.53 44.58,46.86 44.58,40.32 | 44.58,40.32 C16.1 | LDO.G 46.99,38.1 46.48,37.59 C15.1 44.58,37.65 44.58,40.32
N$16
  Top 0.813: TP4.P$1 14.43,44.45 DC_JACK_2MM.3
  Bottom 2.032: DC_JACK_2MM.3 13.92,51.9 V12.2
N$17
  Top 0.813: R16.1 LED_VAL1.A
N$18
  Top 1.016: PUMP1.1 56.15,66.31 55.88,66.04 53.34,66.04 52.07,64.77 D2.A 55.88,62.23 57.15,60.96 N-MF1.3
N$19
  Top 1.016: PUMP2.1 68.85,66.31 68.58,66.04 66.04,66.04 64.77,64.77 D6.A 68.58,62.23 69.85,60.96 N-MF2.3
N$20
  Top 0.813: R19.1 LED_VAL2.A
N$21
  Top 0.61: RESET1.1 TP6.P$1 58.42,44.45 58.42,38.1 ARDUINO_NANO.13
N$22
  Top 0.406: TP2.P$1 ON_SWITCH.1
  Top 1.27: VCC_IN.2 12.68,34.27 ON_SWITCH.1
N$23
  Top 0.813: LED_VAL3.A R20.1
N$24
  Top 0.813: LED_VAL4.A R21.1
N$25
  Top 0.813: LED_MOT1.A R22.1
N$26
  Top 0.813: LED_MOT2.A R23.1
RTC_SQW  (via drill 0.6)
  Top 0.61: RTC.2 32.77,44.7 36.83,40.64 v36.83,30.48
  Bottom 0.61: v36.83,30.48 ARDUINO_NANO.20
S_AN_1
  Top 0.61: ARDUINO_NANO.6 60.01,21.91 C8.1 60.01,23.18 60.58,23.75 62.61,23.75 64.26,22.1 64.26,20.83 64.77,20.32 68.07,20.32 69.34,19.05 69.34,13.21 69.86,12.69 S_AN_1.2
S_AN_2
  Top 0.61: ARDUINO_NANO.7 57.91,22.35 57.91,24.89 58.42,25.4 C13.1 59.69,25.72 59.69,26.92 60.2,27.43 64.64,27.43 67.95,24.12 S_AN_2.2
S_AN_3
  Top 0.61: ARDUINO_NANO.10 57.15,29.21 C10.1 59.69,29.53 59.69,30.48 60.2,30.99 62.96,30.99 63.88,31.91 63.88,34.67 64.77,35.56 64.78,35.55 S_AN_3.2
S_AN_4
  Top 0.61: S_AN_4.2 64.12,46.98 62.99,45.85 62.99,35.94 62.1,35.05 60.58,35.05 59.69,34.16 59.69,33.4 | C12.1 59.69,33.02 59.69,33.4 | 59.69,33.4 58.8,33.4 ARDUINO_NANO.11
S_HSS
  Top 0.508: 54.23,6.35 57.15,6.35
  Top 0.61: 54.23,6.35 46.99,6.35 ARDUINO_NANO.27 | 57.15,6.35 58.42,5.08 R2.1 R1.1
S_MOT_1
  Top 0.61: R9.1 54.61,48.26 53.34,46.99 53.34,43.18 52.45,42.29 50.42,42.29 48.64,40.51 48.64,37.85 42.29,31.5 42.29,29.59 ARDUINO_NANO.21
  Top 0.813: R22.2 R9.1 R10.2
S_MOT_2  (via drill 0.6)
  Top 0.61: R23.2 64.77,51.31 64.26,50.8 56.64,50.8 55.88,50.04 55.88,47.75 54.61,46.48 54.61,42.67 52.96,41.02 50.8,41.02 49.91,40.13 49.91,36.86 43.56,30.51 43.56,25.02 v44.45,24.13 | ARDUINO_NANO.24 v44.45,20.32
  Top 0.813: R23.2 R17.1 R18.2
  Bottom 0.61: v44.45,20.32 v44.45,24.13
S_VALVE_1  (via drill 0.6)
  Top 0.61: v25.02,27.56 28.83,23.75 33.4,23.75 34.29,22.86 34.29,20.32 39.37,15.24 ARDUINO_NANO.26 | R4.2 11.43,50.8 12.7,49.53 16.51,49.53 19.05,46.99 v19.05,41.91
  Top 0.813: R16.2 R3.1 R4.2
  Bottom 0.61: v19.05,41.91 19.05,39.37 25.02,33.4 v25.02,27.56
S_VALVE_2  (via drill 0.6)
  Top 0.61: v27.94,27.56 30.48,25.02 33.78,25.02 35.56,23.24 35.56,21.21 38.99,17.78 ARDUINO_NANO.25 | R5.1 20.32,49.53 21.59,48.26 v21.59,41.91
  Top 0.813: R19.2 R5.1 R11.2
  Bottom 0.61: v21.59,41.91 21.59,39.37 27.94,33.02 v27.94,27.56
S_VALVE_3  (via drill 0.6)
  Top 0.61: v35.56,51.18 35.56,52.32 35.11,52.77 R13.2 | v35.56,47.88 36.32,47.88 38.1,46.1 38.1,24.13 39.37,22.86 ARDUINO_NANO.23
  Top 0.813: R20.2 R12.1 R13.2
  Bottom 0.61: v35.56,51.18 v35.56,47.88
S_VALVE_4  (via drill 0.6)
  Top 0.61: v38.1,51.18 38.1,52.14 38.73,52.77 R21.2 | ARDUINO_NANO.22 39.75,25.4 39.24,25.91 39.24,46.74 v38.1,47.88
  Top 0.813: R21.2 R14.1 R15.2
  Bottom 0.61: v38.1,51.18 v38.1,47.88
SCL  (via drill 0.6)
  Top 0.61: J1.4 5.08,16.28 6.12,15.24 SCL.1 10.07,15.24 12.3,17.47 12.39,17.47 20.32,25.4 20.32,33.02 21.84,34.54 RTC.6 32.77,34.54 34.29,33.02 34.29,26.67 v35.31,25.65 | ARDUINO_NANO.9 53.34,22.86 v43.18,22.86
  Bottom 0.61: v43.18,22.86 41.91,24.13 36.83,24.13 v35.31,25.65
SD_CLK
  Top 0.61: ARDUINO_NANO.1 55.5,4.7 48.51,4.7 47.24,3.43 40.13,3.43 33.15,10.41 33.15,11.3 32.79,11.66 SC_CARD.5
SD_CS
  Top 0.61: ARDUINO_NANO.28 36.83,13.97 36.83,15.24 32.79,19.28 SC_CARD.2
SD_DI
  Top 0.61: ARDUINO_NANO.29 35.56,12.7 35.56,13.97 32.79,16.74 SC_CARD.3
SD_DO
  Top 0.61: ARDUINO_NANO.30 34.29,11.43 34.29,12.7 32.79,14.2 SC_CARD.4
SDA
  Top 0.61: ARDUINO_NANO.8 54.61,21.59 38.1,21.59 36.83,22.86 36.83,27.05 35.56,28.32 35.56,35.56 34.04,37.08 RTC.5 22.04,37.08 18.29,33.34 18.29,25.91 10.16,17.78 SDA.1 7.12,17.78 6.35,18.55 J1.3
V_BAT
  Top 0.61: V_BAT.1 59.69,19.05 ARDUINO_NANO.5
V_HSS
  Top 0.61: R7.2 68.58,7.18 | 68.73,10.69 68.58,10.54 | 31.66,4.13 SC_CARD.8 | 68.54,22.12 C14.1 | S_AN_4.3 72.55,44.83 | S_AN_3.3 72.68,33.53
  Top 0.813: C7.1 68.58,10.54 68.58,7.18 | S_AN_2.3 72.7,18.74 76.2,15.24 76.2,11.43 75.46,10.69 S_AN_1.3 68.73,10.69 | S_AN_2.3 75.46,22.12 76.2,22.86 76.2,26.67 72.7,30.17 S_AN_3.3 75.46,33.55 76.2,34.29 76.2,38.1 72.7,41.6 S_AN_4.3 | C2.1 C1.1 31.66,4.13 | SC_CARD.8 34.39,1.4 63.84,1.4 65.41,2.96 TP3.P$1 66.66,4.3 P-MF.3 | S_AN_2.3 68.54,22.12 | 72.55,44.83 C11.1 | 72.68,33.53 C9.1
  Top 1.016: P-MF.3 67.12,6.86 68.65,6.86 R7.2
VCC  (via drill 0.6)
  Top 0.61: C4.1 29.28,29.46 | 26.78,29.46 C3.1 26.62,29.46 | J1.2 6.85,19.55 7.62,20.32 VCC.1 10.16,20.32 16.51,26.67 v16.51,29.46 13.9,29.46 R8.2 | R2.2 62.28,5.45
  Top 0.813: RTC.8 29.28,29.46 26.78,29.46 | 26.62,29.46 v21.59,29.46 | 62.28,5.45 P-MF.2 | VCC_OUT.1 60.07,37.21 TP1.P$1 ARDUINO_NANO.12 55.56,32.7 C6.1 C5.1 48.19,32.7 v44.83,29.34 44.83,25.91 46.56,24.17 v50.76,24.17
  Top 1.016: v50.8,19.43 v50.8,7.62 | R2.2 61.91,4 60.83,2.92 v50.8,2.92 | LDO.S 51.54,36.09 52.07,35.56 C6.1
  Bottom 0.61: 39.54,29.3 44.79,29.3 v44.83,29.34
  Bottom 0.813: v21.59,29.46 v16.51,29.46 | RTC.8 31.92,29.3 39.54,29.3
  Bottom 1.016: v50.76,24.17 50.8,24.13 v50.8,19.43 | v50.8,7.62 v50.8,2.92

### Text on the board
tPlace: 12V | 12V | 12V | 12V | 12V | 12V | Valve 1 | Valve 2 | Valve 3 | Valve 4 | Pump 1 | Pump 2 | GND | GND | 12V | Reset | Sensor 4 | VCC | VCC | GND | GND | GND | LDO 5V | VCC | Sensor 3 | VCC | VCC | GND | GND | On | Sensor 2 | GND | VCC | VCC | SDA | AN in | GND | I2C Bus | SCL | Status | Sensor 1 | VCC | Arduino Nano | HSS
bPlace: Arduino Watering System | Version 3.1 | Built 04-2022 | JLCJLCJLCJLC
tDocu: JST PH2P ST90 | OPL: / Fix positioning of silkscreen sensors/analog ins | JST PH3P ST90 | JST SH 1mm